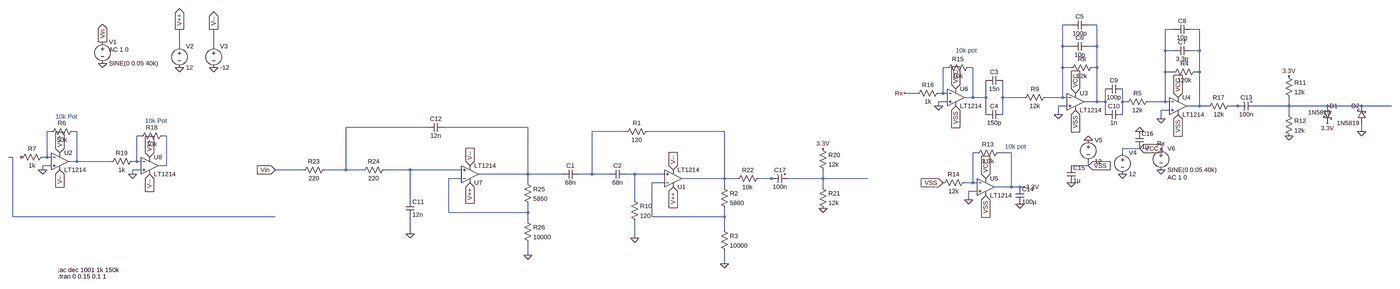
[diagram p0: schematic bandpassCascade.asc, whole sheet]
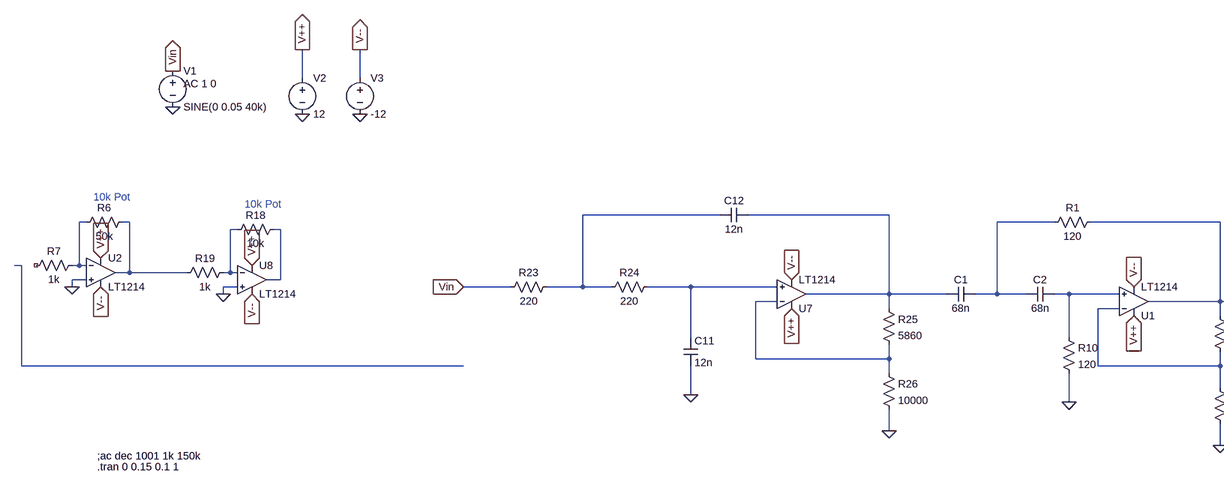
[diagram p1: schematic bandpassCascade.asc, part, row 1 of 1, column 1 of 2]
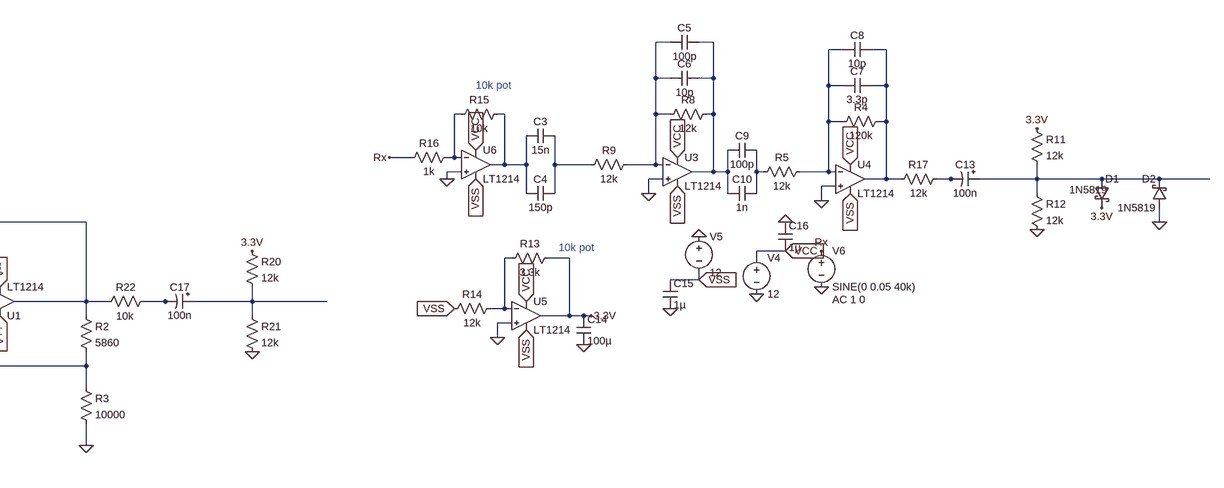
[diagram p2: schematic bandpassCascade.asc, part, row 1 of 1, column 2 of 2]
bandpassCascade.asc, the LTspice schematic file:
Version 4
SHEET 1 5732 1108
WIRE 4352 -400 4320 -400
WIRE 4448 -400 4416 -400
WIRE 4736 -384 4704 -384
WIRE 4832 -384 4800 -384
WIRE -16 -320 -16 -384
WIRE 112 -320 112 -384
WIRE 4320 -320 4320 -400
WIRE 4352 -320 4320 -320
WIRE 4448 -320 4448 -400
WIRE 4448 -320 4416 -320
WIRE 4704 -304 4704 -384
WIRE 4736 -304 4704 -304
WIRE 4832 -304 4832 -384
WIRE 4832 -304 4800 -304
WIRE 3888 -240 3872 -240
WIRE 3984 -240 3968 -240
WIRE 4320 -240 4320 -320
WIRE 4352 -240 4320 -240
WIRE 4448 -240 4448 -320
WIRE 4448 -240 4432 -240
WIRE 4704 -224 4704 -304
WIRE 4736 -224 4704 -224
WIRE 4832 -224 4832 -304
WIRE 4832 -224 4816 -224
WIRE 3776 -144 3728 -144
WIRE 3872 -144 3872 -240
WIRE 3872 -144 3856 -144
WIRE 3888 -144 3872 -144
WIRE 3984 -128 3984 -240
WIRE 3984 -128 3952 -128
WIRE 4032 -128 4032 -192
WIRE 4032 -128 3984 -128
WIRE 4096 -128 4096 -192
WIRE 4176 -128 4096 -128
WIRE 4320 -128 4320 -240
WIRE 4320 -128 4256 -128
WIRE 4336 -128 4320 -128
WIRE 3888 -112 3856 -112
WIRE 4448 -112 4448 -240
WIRE 4448 -112 4400 -112
WIRE 4480 -112 4480 -160
WIRE 4480 -112 4448 -112
WIRE 4544 -112 4544 -160
WIRE 4560 -112 4544 -112
WIRE 4704 -112 4704 -224
WIRE 4704 -112 4640 -112
WIRE 4720 -112 4704 -112
WIRE 3856 -96 3856 -112
WIRE 4336 -96 4304 -96
WIRE 4832 -96 4832 -224
WIRE 4832 -96 4784 -96
WIRE 4864 -96 4832 -96
WIRE 4976 -96 4944 -96
WIRE 4992 -96 4976 -96
WIRE 5344 -96 5344 -128
WIRE 5344 -96 5040 -96
WIRE 5488 -96 5344 -96
WIRE 5616 -96 5488 -96
WIRE 5728 -96 5616 -96
WIRE 4720 -80 4688 -80
WIRE 4032 -64 4032 -128
WIRE 4096 -64 4096 -128
WIRE 4304 -64 4304 -96
WIRE 4480 -64 4480 -112
WIRE 4544 -64 4544 -112
WIRE 5344 -64 5344 -96
WIRE 4688 -48 4688 -80
WIRE 1488 -16 1184 -16
WIRE 1888 -16 1552 -16
WIRE -496 0 -512 0
WIRE -400 0 -416 0
WIRE 2256 0 2128 0
WIRE 2624 0 2336 0
WIRE 5616 0 5616 -32
WIRE -160 16 -176 16
WIRE -64 16 -80 16
WIRE 4608 64 4544 64
WIRE 4000 80 3984 80
WIRE 4128 80 4080 80
WIRE 4544 80 4544 64
WIRE -640 96 -656 96
WIRE -512 96 -512 0
WIRE -512 96 -528 96
WIRE -496 96 -512 96
WIRE -400 112 -400 0
WIRE -400 112 -432 112
WIRE -272 112 -400 112
WIRE -176 112 -176 16
WIRE -176 112 -192 112
WIRE -160 112 -176 112
WIRE -496 128 -528 128
WIRE -64 128 -64 16
WIRE -64 128 -96 128
WIRE 4416 128 4416 112
WIRE 4416 128 4352 128
WIRE -528 144 -528 128
WIRE -160 144 -192 144
WIRE 1024 144 816 144
WIRE 1184 144 1184 -16
WIRE 1184 144 1104 144
WIRE 1248 144 1184 144
WIRE 1424 144 1328 144
WIRE 1616 144 1424 144
WIRE -192 160 -192 144
WIRE 1888 160 1888 -16
WIRE 1888 160 1680 160
WIRE 2016 160 1888 160
WIRE 2128 160 2128 0
WIRE 2128 160 2080 160
WIRE 2192 160 2128 160
WIRE 2288 160 2256 160
WIRE 2400 160 2288 160
WIRE 1616 176 1568 176
WIRE 2624 176 2624 0
WIRE 2624 176 2464 176
WIRE 2672 176 2624 176
WIRE 2800 176 2752 176
WIRE 2816 176 2800 176
WIRE 3168 176 3168 144
WIRE 3168 176 2864 176
WIRE 3360 176 3168 176
WIRE 1888 192 1888 160
WIRE 2400 192 2352 192
WIRE 3984 192 3984 80
WIRE 3984 192 3952 192
WIRE 4000 192 3984 192
WIRE 2624 208 2624 176
WIRE 3168 208 3168 176
WIRE 4128 208 4128 80
WIRE 4128 208 4064 208
WIRE 4160 208 4128 208
WIRE 4176 208 4160 208
WIRE 4000 224 3968 224
WIRE 1424 256 1424 144
WIRE 2288 256 2288 160
WIRE 3968 256 3968 224
WIRE 1568 304 1568 176
WIRE 1888 304 1888 272
WIRE 1888 304 1568 304
WIRE -640 320 -640 96
WIRE 816 320 -640 320
WIRE 2352 320 2352 192
WIRE 2624 320 2624 288
WIRE 2624 320 2352 320
WIRE 1888 336 1888 304
WIRE 2624 368 2624 320
WIRE 1424 384 1424 320
WIRE 2288 400 2288 336
WIRE 1888 464 1888 416
WIRE 2624 496 2624 448
FLAG -16 -240 0
FLAG 112 -240 0
FLAG -16 -384 V++
IOPIN -16 -384 Out
FLAG 112 -384 V--
IOPIN 112 -384 Out
FLAG -304 -256 0
FLAG -304 -336 Vin
IOPIN -304 -336 Out
FLAG -528 144 0
FLAG -464 144 V--
IOPIN -464 144 In
FLAG -464 80 V++
IOPIN -464 80 In
FLAG 2432 144 V--
IOPIN 2432 144 In
FLAG 2432 208 V++
IOPIN 2432 208 In
FLAG 2624 496 0
FLAG 2288 400 0
FLAG 1424 384 0
FLAG 1648 128 V--
IOPIN 1648 128 In
FLAG 1648 192 V++
IOPIN 1648 192 In
FLAG 1888 464 0
FLAG 4688 -48 0
FLAG 4544 160 0
FLAG 4416 32 0
FLAG 4752 -128 VCC
IOPIN 4752 -128 In
FLAG 4752 -64 VSS
IOPIN 4752 -64 In
FLAG 4688 144 0
FLAG 4304 -64 0
FLAG 4368 -144 VCC
IOPIN 4368 -144 In
FLAG 4368 -80 VSS
IOPIN 4368 -80 In
FLAG 5344 16 0
FLAG 5344 -208 3.3V
FLAG 4176 208 3.3V
FLAG 3968 256 0
FLAG 4032 176 VCC
IOPIN 4032 176 In
FLAG 4032 240 VSS
IOPIN 4032 240 In
FLAG 3872 192 VSS
IOPIN 3872 192 In
FLAG 4688 64 Rx
FLAG 5616 0 0
FLAG 5488 -32 3.3V
FLAG 3856 -96 0
FLAG 3728 -144 Rx
FLAG 3920 -96 VSS
IOPIN 3920 -96 In
FLAG 3920 -160 VCC
IOPIN 3920 -160 In
FLAG 4160 272 0
FLAG 4352 192 0
FLAG 4608 0 0
FLAG 4416 128 VSS
IOPIN 4416 128 In
FLAG 4608 64 VCC
IOPIN 4608 64 In
FLAG -192 160 0
FLAG -128 160 V--
IOPIN -128 160 In
FLAG -128 96 V++
IOPIN -128 96 In
FLAG 3168 288 0
FLAG 3168 64 3.3V
FLAG 816 144 Vin
IOPIN 816 144 In
SYMBOL voltage -16 -336 R0
WINDOW 123 0 0 Left 0
WINDOW 39 0 0 Left 0
SYMATTR InstName V2
SYMATTR Value 12
SYMBOL voltage 112 -336 R0
WINDOW 123 0 0 Left 0
WINDOW 39 0 0 Left 0
SYMATTR InstName V3
SYMATTR Value -12
SYMBOL voltage -304 -352 R0
WINDOW 123 24 44 Left 2
WINDOW 39 0 0 Left 0
SYMATTR Value2 AC 1 0
SYMATTR InstName V1
SYMATTR Value SINE(0 0.05 40k)
SYMBOL Opamps\\LT1214 -464 48 R0
SYMATTR InstName U2
SYMBOL res -400 -16 R90
WINDOW 0 0 56 VBottom 2
WINDOW 3 32 56 VTop 2
SYMATTR InstName R6
SYMATTR Value 50k
SYMBOL res -512 80 R90
WINDOW 0 0 56 VBottom 2
WINDOW 3 32 56 VTop 2
SYMATTR InstName R7
SYMATTR Value 1k
SYMBOL cap 2080 144 R90
WINDOW 0 0 32 VBottom 2
WINDOW 3 32 32 VTop 2
SYMATTR InstName C1
SYMATTR Value 68n
SYMBOL cap 2256 144 R90
WINDOW 0 0 32 VBottom 2
WINDOW 3 32 32 VTop 2
SYMATTR InstName C2
SYMATTR Value 68n
SYMBOL Opamps\\LT1214 2432 240 M180
SYMATTR InstName U1
SYMBOL res 2352 -16 R90
WINDOW 0 0 56 VBottom 2
WINDOW 3 32 56 VTop 2
SYMATTR InstName R1
SYMATTR Value 120
SYMBOL res 2608 192 R0
SYMATTR InstName R2
SYMATTR Value 5860
SYMBOL res 2608 352 R0
SYMATTR InstName R3
SYMATTR Value 10000
SYMBOL res 2272 240 R0
SYMATTR InstName R10
SYMATTR Value 120
SYMBOL res 1120 128 R90
WINDOW 0 0 56 VBottom 2
WINDOW 3 32 56 VTop 2
SYMATTR InstName R23
SYMATTR Value 220
SYMBOL res 1344 128 R90
WINDOW 0 0 56 VBottom 2
WINDOW 3 32 56 VTop 2
SYMATTR InstName R24
SYMATTR Value 220
SYMBOL cap 1408 256 R0
SYMATTR InstName C11
SYMATTR Value 12n
SYMBOL cap 1552 -32 R90
WINDOW 0 0 32 VBottom 2
WINDOW 3 32 32 VTop 2
SYMATTR InstName C12
SYMATTR Value 12n
SYMBOL Opamps\\LT1214 1648 224 M180
SYMATTR InstName U7
SYMBOL res 1872 176 R0
SYMATTR InstName R25
SYMATTR Value 5860
SYMBOL res 1872 320 R0
SYMATTR InstName R26
SYMATTR Value 10000
SYMBOL voltage 4544 64 R0
WINDOW 123 0 0 Left 0
WINDOW 39 0 0 Left 0
SYMATTR InstName V4
SYMATTR Value 12
SYMBOL voltage 4416 16 R0
WINDOW 123 0 0 Left 0
WINDOW 39 0 0 Left 0
SYMATTR InstName V5
SYMATTR Value 12
SYMBOL res 4832 -240 R90
WINDOW 0 0 56 VBottom 2
WINDOW 3 32 56 VTop 2
SYMATTR InstName R4
SYMATTR Value 120k
SYMBOL res 4656 -128 R90
WINDOW 0 0 56 VBottom 2
WINDOW 3 32 56 VTop 2
SYMATTR InstName R5
SYMATTR Value 12k
SYMBOL res 4448 -256 R90
WINDOW 0 0 56 VBottom 2
WINDOW 3 32 56 VTop 2
SYMATTR InstName R8
SYMATTR Value 12k
SYMBOL res 4272 -144 R90
WINDOW 0 0 56 VBottom 2
WINDOW 3 32 56 VTop 2
SYMATTR InstName R9
SYMATTR Value 12k
SYMBOL Opamps\\LT1214 4368 -176 R0
SYMATTR InstName U3
SYMBOL Opamps\\LT1214 4752 -160 R0
SYMATTR InstName U4
SYMBOL cap 4096 -208 R90
WINDOW 0 0 32 VBottom 2
WINDOW 3 32 32 VTop 2
SYMATTR InstName C3
SYMATTR Value 15n
SYMBOL cap 4096 -80 R90
WINDOW 0 0 32 VBottom 2
WINDOW 3 32 32 VTop 2
SYMATTR InstName C4
SYMATTR Value 150p
SYMBOL cap 4416 -416 R90
WINDOW 0 0 32 VBottom 2
WINDOW 3 32 32 VTop 2
SYMATTR InstName C5
SYMATTR Value 100p
SYMBOL cap 4416 -336 R90
WINDOW 0 0 32 VBottom 2
WINDOW 3 32 32 VTop 2
SYMATTR InstName C6
SYMATTR Value 10p
SYMBOL cap 4800 -320 R90
WINDOW 0 0 32 VBottom 2
WINDOW 3 32 32 VTop 2
SYMATTR InstName C7
SYMATTR Value 3.3p
SYMBOL cap 4800 -400 R90
WINDOW 0 0 32 VBottom 2
WINDOW 3 32 32 VTop 2
SYMATTR InstName C8
SYMATTR Value 10p
SYMBOL cap 4544 -176 R90
WINDOW 0 0 32 VBottom 2
WINDOW 3 32 32 VTop 2
SYMATTR InstName C9
SYMATTR Value 100p
SYMBOL cap 4544 -80 R90
WINDOW 0 0 32 VBottom 2
WINDOW 3 32 32 VTop 2
SYMATTR InstName C10
SYMATTR Value 1n
SYMBOL polcap 5040 -112 R90
WINDOW 0 0 32 VBottom 2
WINDOW 3 32 32 VTop 2
SYMATTR InstName C13
SYMATTR Value 100n
SYMBOL res 5328 -224 R0
SYMATTR InstName R11
SYMATTR Value 12k
SYMBOL res 5328 -80 R0
SYMATTR InstName R12
SYMATTR Value 12k
SYMBOL Opamps\\LT1214 4032 144 R0
SYMATTR InstName U5
SYMBOL res 4096 64 R90
WINDOW 0 0 56 VBottom 2
WINDOW 3 32 56 VTop 2
SYMATTR InstName R13
SYMATTR Value 3.3k
SYMBOL res 3968 176 R90
WINDOW 0 0 56 VBottom 2
WINDOW 3 32 56 VTop 2
SYMATTR InstName R14
SYMATTR Value 12k
SYMBOL voltage 4688 48 R0
WINDOW 123 24 124 Left 2
WINDOW 39 0 0 Left 0
SYMATTR Value2 AC 1 0
SYMATTR InstName V6
SYMATTR Value SINE(0 0.05 40k)
SYMBOL schottky 5472 -96 R0
WINDOW 3 -56 24 Left 2
SYMATTR Value 1N5819
SYMATTR InstName D1
SYMATTR Description Diode
SYMATTR Type diode
SYMBOL schottky 5632 -32 R180
WINDOW 0 24 64 Left 2
WINDOW 3 24 0 Left 2
SYMATTR InstName D2
SYMATTR Value 1N5819
SYMATTR Description Diode
SYMATTR Type diode
SYMBOL Opamps\\LT1214 3920 -192 R0
SYMATTR InstName U6
SYMBOL res 3984 -256 R90
WINDOW 0 0 56 VBottom 2
WINDOW 3 32 56 VTop 2
SYMATTR InstName R15
SYMATTR Value 10k
SYMBOL res 3872 -160 R90
WINDOW 0 0 56 VBottom 2
WINDOW 3 32 56 VTop 2
SYMATTR InstName R16
SYMATTR Value 1k
SYMBOL cap 4144 208 R0
SYMATTR InstName C14
SYMATTR Value 100µ
SYMBOL res 4960 -112 R90
WINDOW 0 0 56 VBottom 2
WINDOW 3 32 56 VTop 2
SYMATTR InstName R17
SYMATTR Value 12k
SYMBOL cap 4336 128 R0
SYMATTR InstName C15
SYMATTR Value 1µ
SYMBOL cap 4592 0 R0
SYMATTR InstName C16
SYMATTR Value 1µ
SYMBOL Opamps\\LT1214 -128 64 R0
SYMATTR InstName U8
SYMBOL res -64 0 R90
WINDOW 0 0 56 VBottom 2
WINDOW 3 32 56 VTop 2
SYMATTR InstName R18
SYMATTR Value 10k
SYMBOL res -176 96 R90
WINDOW 0 0 56 VBottom 2
WINDOW 3 32 56 VTop 2
SYMATTR InstName R19
SYMATTR Value 1k
SYMBOL polcap 2864 160 R90
WINDOW 0 0 32 VBottom 2
WINDOW 3 32 32 VTop 2
SYMATTR InstName C17
SYMATTR Value 100n
SYMBOL res 3152 48 R0
SYMATTR InstName R20
SYMATTR Value 12k
SYMBOL res 3152 192 R0
SYMATTR InstName R21
SYMATTR Value 12k
SYMBOL res 2768 160 R90
WINDOW 0 0 56 VBottom 2
WINDOW 3 33 58 VTop 2
SYMATTR InstName R22
SYMATTR Value 10k
TEXT -472 520 Left 2 !;ac dec 1001 1k 150k
TEXT -480 -56 Left 2 ;10k Pot
TEXT 3920 -304 Left 2 ;10k pot
TEXT 4104 56 Left 2 ;10k pot
TEXT -144 -40 Left 2 ;10k Pot
TEXT -472 544 Left 2 !.tran 0 0.15 0.1 1

The netlist it stands for:
* bandpassCascade.asc
V2 V++ 0 12
V3 V-- 0 -12
V1 Vin 0 SINE(0 0.05 40k) AC 1 0
XU2 0 N013 V++ V-- N014 LT1213  ; LT1214, pins In+ In- V+ V- OUT
R6 N014 N013 50k
R7 N013 NC_01 1k
C1 N015 N012 68n
C2 N022 N015 68n
XU1 N022 N026 V++ V-- N016 LT1213  ; LT1214, pins In+ In- V+ V- OUT
R1 N016 N015 120
R2 N016 N026 5860
R3 N026 0 10000
R10 N022 0 120
R23 N011 Vin 220
R24 N021 N011 220
C11 N021 0 12n
C12 N012 N011 12n
XU7 N021 N023 V++ V-- N012 LT1213  ; LT1214, pins In+ In- V+ V- OUT
R25 N012 N023 5860
R26 N023 0 10000
V4 VCC 0 12
V5 0 VSS 12
R4 N004 N003 120k
R5 N003 N008 12k
R8 N002 N001 12k
R9 N001 N007 12k
XU3 0 N001 VCC VSS N002 LT1213  ; LT1214, pins In+ In- V+ V- OUT
XU4 0 N003 VCC VSS N004 LT1213  ; LT1214, pins In+ In- V+ V- OUT
C3 N007 N006 15n
C4 N007 N006 150p
C5 N002 N001 100p
C6 N002 N001 10p
C7 N004 N003 3.3p
C8 N004 N003 10p
C9 N008 N002 100p
C10 N008 N002 1n
C13 N010 N009 100n
R11 3.3V N010 12k
R12 N010 0 12k
XU5 0 N019 VCC VSS 3.3V LT1213  ; LT1214, pins In+ In- V+ V- OUT
R13 3.3V N019 3.3k
R14 N019 VSS 12k
V6 Rx 0 SINE(0 0.05 40k) AC 1 0
D1 N010 3.3V 1N5819
D2 0 N010 1N5819
XU6 0 N005 VCC VSS N006 LT1213  ; LT1214, pins In+ In- V+ V- OUT
R15 N006 N005 10k
R16 N005 Rx 1k
C14 3.3V 0 100µ
R17 N009 N004 12k
C15 VSS 0 1µ
C16 0 VCC 1µ
XU8 0 N017 V++ V-- N018 LT1213  ; LT1214, pins In+ In- V+ V- OUT
R18 N018 N017 10k
R19 N017 N014 1k
C17 N025 N024 100n
R20 3.3V N025 12k
R21 N025 0 12k
R22 N024 N016 10k
.model D D
.lib standard.dio
;ac dec 1001 1k 150k
* 10k Pot
* 10k pot
* 10k pot
* 10k Pot
.tran 0 0.15 0.1 1
.lib LTC.lib
.backanno
.end